# Altium schematic sheet Sensors.SchDoc
size A4
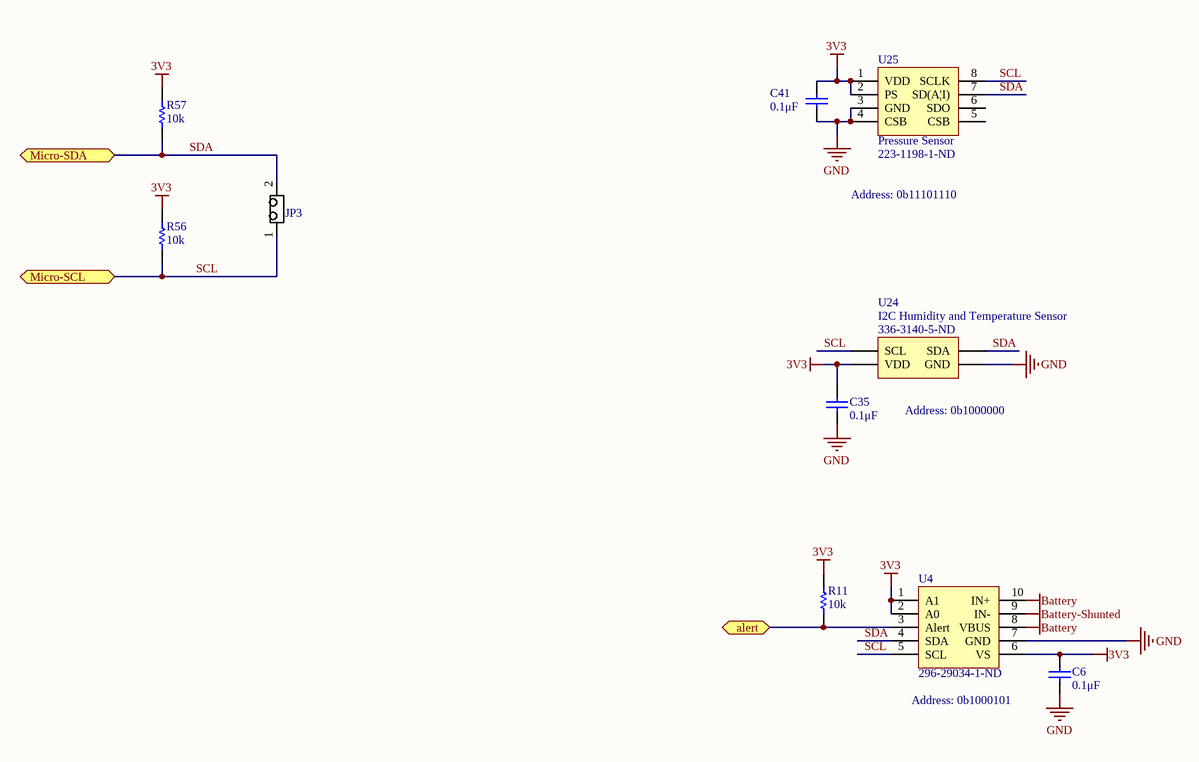
[diagram p0: Sensors.SchDoc]

## Parts
C6  0.1μF  [CAPC1608N(0603")]
C35  0.1μF  [CAPC1608N(0603")]
C41  0.1μF  [CAPC1608N(0603")]
JP3  1X2 Pin Head  [2X1 Males Header]  (value not drawn)
R11  10k  [RESC1608N(0603")]
R56  10k  [RESC1608N(0603")]
R57  10k  [RESC1608N(0603")]
U4  Supplier Part Number 1: 296-29034-1-ND  [MSOP-10]  (hidden comment: High side current sensor)
U24  I2C Humidity and Temperature Sensor  Supplier Part Number 1: 336-3140-5-ND  [QFN-6]
U25  Pressure Sensor  Supplier Part Number 1: 223-1198-1-ND  [TE Pressure Sensor (MS560702BA03-50)]

## Ports
alert, Micro-SCL, Micro-SDA

## Nets
3V3: C6.1(Anode) C35.1(Anode) C41.2(Cathode) R11.2 R56.2 R57.2 U4.1(A1) U4.2(A0) U4.6(VS) U24.5(VDD) U25.1(VDD) U25.2(PS)
Battery: U4.8(VBUS) U4.10(IN+)
Battery-Shunted: U4.9(IN-)
GND: C6.2(Cathode) C35.2(Cathode) C41.1(Anode) U4.7(GND) U24.2(GND) U25.3(GND) U25.4(CSB)
alert: R11.1 U4.3(Alert) ; port alert
SCL: JP3.1 R56.1 U4.5(SCL) U24.6(SCL) U25.8(SCLK) ; port Micro-SCL
SDA: JP3.2 R57.1 U4.4(SDA) U24.1(SDA) U25.7(SD(A|I)) ; port Micro-SDA

Not connected (* = marked no-connect by the designer): U25 5(CSB) 6(SDO)

## Notes on the sheet
- Address: 0b11101110
- (near U24) Address: 0b1000000
- Address: 0b1000101

## Library data of the parts
C6 C35 C41 = 0.1uF 100V 0603 SMD, Ceramic: Capacitor, Ceramic, 100V, +/- 10%, 0603 SMD, X7R; MFG: TDK; MFG#: CGA3E3X7S2A104K080AB; Published: 16-04-26; Publisher: AUVic; PackageDescription: Chip Capacitor; Value: 0.1μF; Created By: Ashwin Sira; Supplier 1: Digi-Key; Supplier Part Number 1: 445-6938-1-ND
JP3 = 1x2 Male Header: Made By: Andy Bates; Supplier 1: Digi-Key; Supplier Part Number 1: 952-3073-ND
R11 R56 R57 = 10kR, 1%, 1/10W, 0603 SMD: Made By: Ashwin Sira; Owned By: AUVic; Created On: 14-05-31; Last Edited: 14-05-31; Supplier 1: Digi-Key; Supplier Part Number 1: 311-10.0KHRCT-ND; Value: 10k
U4 = INA226AIDGSR, Current Sensor, High Side: 0-36V High side current sensor; Made by: Andy Bates; Created on: 2016-09-06; Supplier 1: Digi-Key
U24 = Si700XX: Made by: Andy Bates; Supplier 1: Digi-Key; Created on: 2019/09/08
U25 = MS560702BA03-50 Pressure Sensor: 1kPa to 120 kPa; Made by: Andy Bates; Created on: 2017-09-11; Supplier 1: Digi-Key